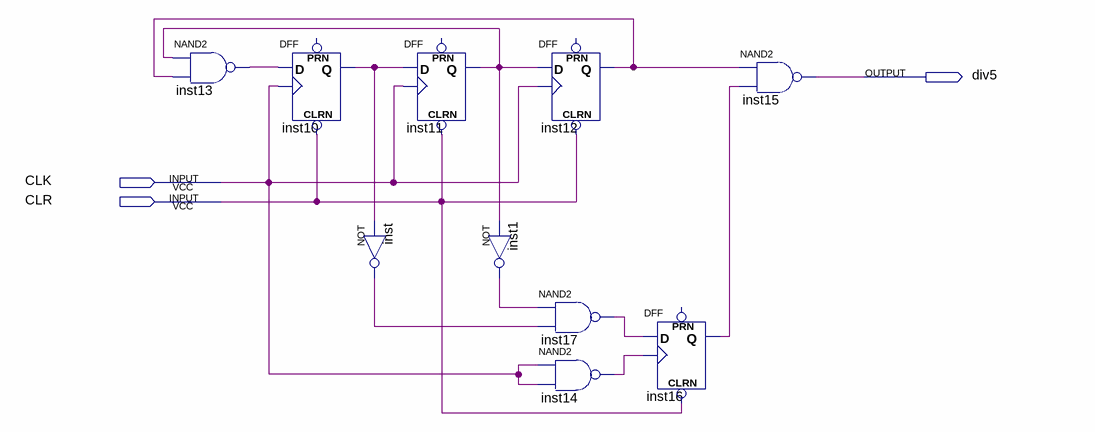
[diagram p0: schematic sheet]
// Quartus schematic div5.bdf as structural Verilog: 10 symbols, 3 pins
module div5 (
  input  CLK,
  input  CLR,
  output div5
);

  wire inst1_out, inst10_q, inst11_q, inst12_q, inst13_out, inst14_out, inst16_q, inst17_out, inst_out;

  nand inst13 (inst13_out, inst11_q, inst12_q);
  DFF inst10 (.CLRN(CLR), .CLK(CLK), .D(inst13_out), .Q(inst10_q));  // open: PRN
  not inst (inst_out, inst10_q);
  DFF inst11 (.CLRN(CLR), .CLK(CLK), .D(inst10_q), .Q(inst11_q));  // open: PRN
  not inst1 (inst1_out, inst11_q);
  DFF inst12 (.CLRN(CLR), .CLK(CLK), .D(inst11_q), .Q(inst12_q));  // open: PRN
  nand inst17 (inst17_out, inst1_out, inst_out);
  nand inst14 (inst14_out, CLK, CLK);
  DFF inst16 (.CLRN(CLR), .CLK(inst14_out), .D(inst17_out), .Q(inst16_q));  // open: PRN
  nand inst15 (div5, inst12_q, inst16_q);
endmodule
